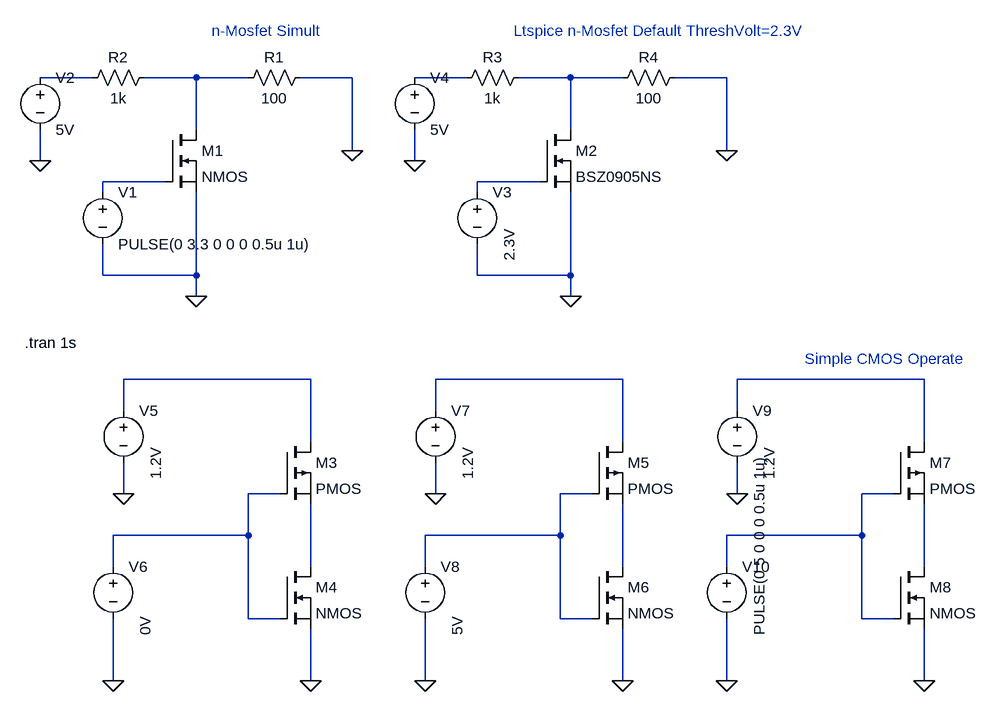
[diagram p0: schematic Simple_Mosfet_CMos.asc]
Simple_Mosfet_CMos.asc, the LTspice schematic file:
Version 4
SHEET 1 1316 964
WIRE -48 16 -128 16
WIRE 112 16 32 16
WIRE 192 16 112 16
WIRE 352 16 272 16
WIRE 528 16 448 16
WIRE 688 16 608 16
WIRE 768 16 688 16
WIRE 928 16 848 16
WIRE 112 96 112 16
WIRE 688 96 688 16
WIRE 352 128 352 16
WIRE 928 128 928 16
WIRE -128 144 -128 96
WIRE 448 144 448 96
WIRE 64 176 -32 176
WIRE 640 176 544 176
WIRE -32 192 -32 176
WIRE 544 192 544 176
WIRE -32 320 -32 272
WIRE 112 320 112 192
WIRE 112 320 -32 320
WIRE 544 320 544 272
WIRE 688 320 688 192
WIRE 688 320 544 320
WIRE 112 352 112 320
WIRE 688 352 688 320
WIRE 288 480 0 480
WIRE 768 480 480 480
WIRE 1232 480 944 480
WIRE 0 528 0 480
WIRE 480 528 480 480
WIRE 944 528 944 480
WIRE 288 576 288 480
WIRE 768 576 768 480
WIRE 1232 576 1232 480
WIRE 0 656 0 608
WIRE 240 656 192 656
WIRE 480 656 480 608
WIRE 720 656 672 656
WIRE 944 656 944 608
WIRE 1184 656 1136 656
WIRE 192 720 192 656
WIRE 192 720 -16 720
WIRE 672 720 672 656
WIRE 672 720 464 720
WIRE 1136 720 1136 656
WIRE 1136 720 928 720
WIRE -16 768 -16 720
WIRE 288 768 288 672
WIRE 464 768 464 720
WIRE 768 768 768 672
WIRE 928 768 928 720
WIRE 1232 768 1232 672
WIRE 192 848 192 720
WIRE 240 848 192 848
WIRE 672 848 672 720
WIRE 720 848 672 848
WIRE 1136 848 1136 720
WIRE 1184 848 1136 848
WIRE -16 944 -16 848
WIRE 288 944 288 864
WIRE 464 944 464 848
WIRE 768 944 768 864
WIRE 928 944 928 848
WIRE 1232 944 1232 864
FLAG 112 352 0
FLAG -128 144 0
FLAG 352 128 0
FLAG 688 352 0
FLAG 448 144 0
FLAG 928 128 0
FLAG 288 944 0
FLAG -16 944 0
FLAG 0 656 0
FLAG 768 944 0
FLAG 464 944 0
FLAG 480 656 0
FLAG 1232 944 0
FLAG 928 944 0
FLAG 944 656 0
SYMBOL nmos 64 96 R0
SYMATTR InstName M1
SYMBOL voltage -32 176 R0
WINDOW 123 0 0 Left 0
WINDOW 39 0 0 Left 0
SYMATTR InstName V1
SYMATTR Value PULSE(0 3.3 0 0 0 0.5u 1u)
SYMBOL voltage -128 0 R0
SYMATTR InstName V2
SYMATTR Value 5V
SYMBOL res 48 0 R90
WINDOW 0 0 56 VBottom 2
WINDOW 3 32 56 VTop 2
SYMATTR InstName R2
SYMATTR Value 1k
SYMBOL res 288 0 R90
WINDOW 0 0 56 VBottom 2
WINDOW 3 32 56 VTop 2
SYMATTR InstName R1
SYMATTR Value 100
SYMBOL nmos 640 96 R0
SYMATTR InstName M2
SYMATTR Value BSZ0905NS
SYMBOL voltage 544 176 R0
WINDOW 3 50 122 VLeft 2
WINDOW 123 0 0 Left 0
WINDOW 39 0 0 Left 0
SYMATTR InstName V3
SYMATTR Value 2.3V
SYMBOL voltage 448 0 R0
SYMATTR InstName V4
SYMATTR Value 5V
SYMBOL res 624 0 R90
WINDOW 0 0 56 VBottom 2
WINDOW 3 32 56 VTop 2
SYMATTR InstName R3
SYMATTR Value 1k
SYMBOL res 864 0 R90
WINDOW 0 0 56 VBottom 2
WINDOW 3 32 56 VTop 2
SYMATTR InstName R4
SYMATTR Value 100
SYMBOL pmos 240 576 R0
SYMATTR InstName M3
SYMBOL nmos 240 768 R0
SYMATTR InstName M4
SYMBOL voltage 0 512 R0
WINDOW 3 50 122 VLeft 2
WINDOW 123 0 0 Left 0
WINDOW 39 0 0 Left 0
SYMATTR InstName V5
SYMATTR Value 1.2V
SYMBOL voltage -16 752 R0
WINDOW 3 50 122 VLeft 2
WINDOW 123 0 0 Left 0
WINDOW 39 0 0 Left 0
SYMATTR InstName V6
SYMATTR Value 0V
SYMBOL pmos 720 576 R0
SYMATTR InstName M5
SYMBOL nmos 720 768 R0
SYMATTR InstName M6
SYMBOL voltage 480 512 R0
WINDOW 3 50 122 VLeft 2
WINDOW 123 0 0 Left 0
WINDOW 39 0 0 Left 0
SYMATTR InstName V7
SYMATTR Value 1.2V
SYMBOL voltage 464 752 R0
WINDOW 3 50 122 VLeft 2
WINDOW 123 0 0 Left 0
WINDOW 39 0 0 Left 0
SYMATTR InstName V8
SYMATTR Value 5V
SYMBOL pmos 1184 576 R0
SYMATTR InstName M7
SYMBOL nmos 1184 768 R0
SYMATTR InstName M8
SYMBOL voltage 944 512 R0
WINDOW 3 50 122 VLeft 2
WINDOW 123 0 0 Left 0
WINDOW 39 0 0 Left 0
SYMATTR InstName V9
SYMATTR Value 1.2V
SYMBOL voltage 928 752 R0
WINDOW 3 50 122 VLeft 2
WINDOW 123 0 0 Left 0
SYMATTR InstName V10
SYMATTR Value PULSE(0 5 0 0 0 0.5u 1u)
TEXT -152 424 Left 2 !.tran 1s
TEXT 136 -56 Left 2 ;n-Mosfet Simult
TEXT 600 -56 Left 2 ;Ltspice n-Mosfet Default ThreshVolt=2.3V
TEXT 1048 448 Left 2 ;Simple CMOS Operate

The netlist it stands for:
* Simple_Mosfet_CMos.asc
M1 N002 N005 0 0 NMOS
V1 N005 0 PULSE(0 3.3 0 0 0 0.5u 1u)
V2 N001 0 5V
R2 N002 N001 1k
R1 0 N002 100
M2 N004 N006 0 0 BSZ0905NS
V3 N006 0 2.3V
V4 N003 0 5V
R3 N004 N003 1k
R4 0 N004 100
M3 N007 N010 N013 N013 PMOS
M4 N013 N010 0 0 NMOS
V5 N007 0 1.2V
V6 N010 0 0V
M5 N008 N011 N014 N014 PMOS
M6 N014 N011 0 0 NMOS
V7 N008 0 1.2V
V8 N011 0 5V
M7 N009 N012 N015 N015 PMOS
M8 N015 N012 0 0 NMOS
V9 N009 0 1.2V
V10 N012 0 PULSE(0 5 0 0 0 0.5u 1u)
.model NMOS NMOS
.model PMOS PMOS
.lib standard.mos
.tran 1s
* n-Mosfet Simult
* Ltspice n-Mosfet Default ThreshVolt=2.3V
* Simple CMOS Operate
.backanno
.end